# EAGLE design mainBoard (EAGLE 9.4.0)
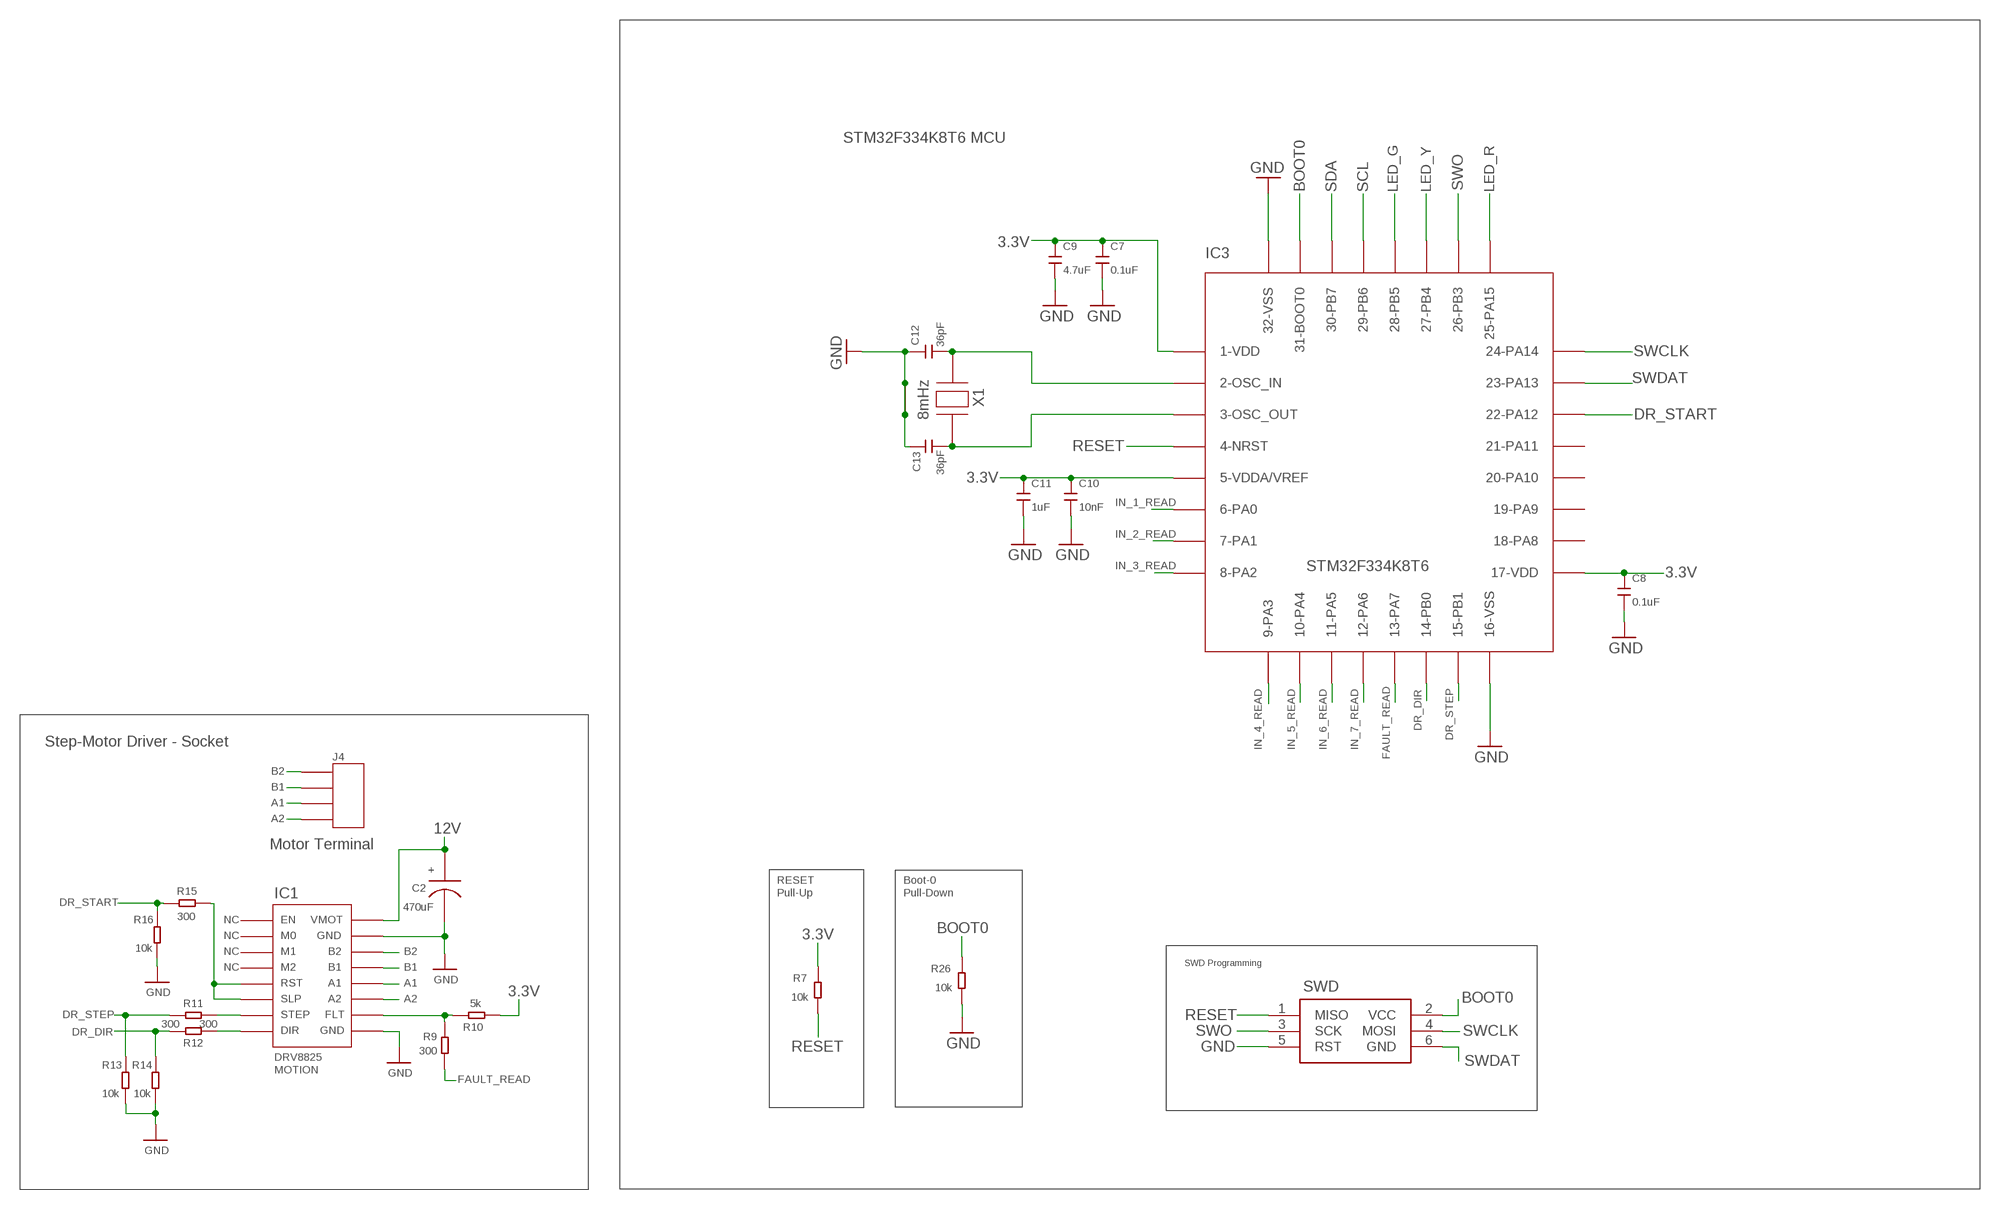
[diagram p0: schematic, sheet 1, part 1 of 2]
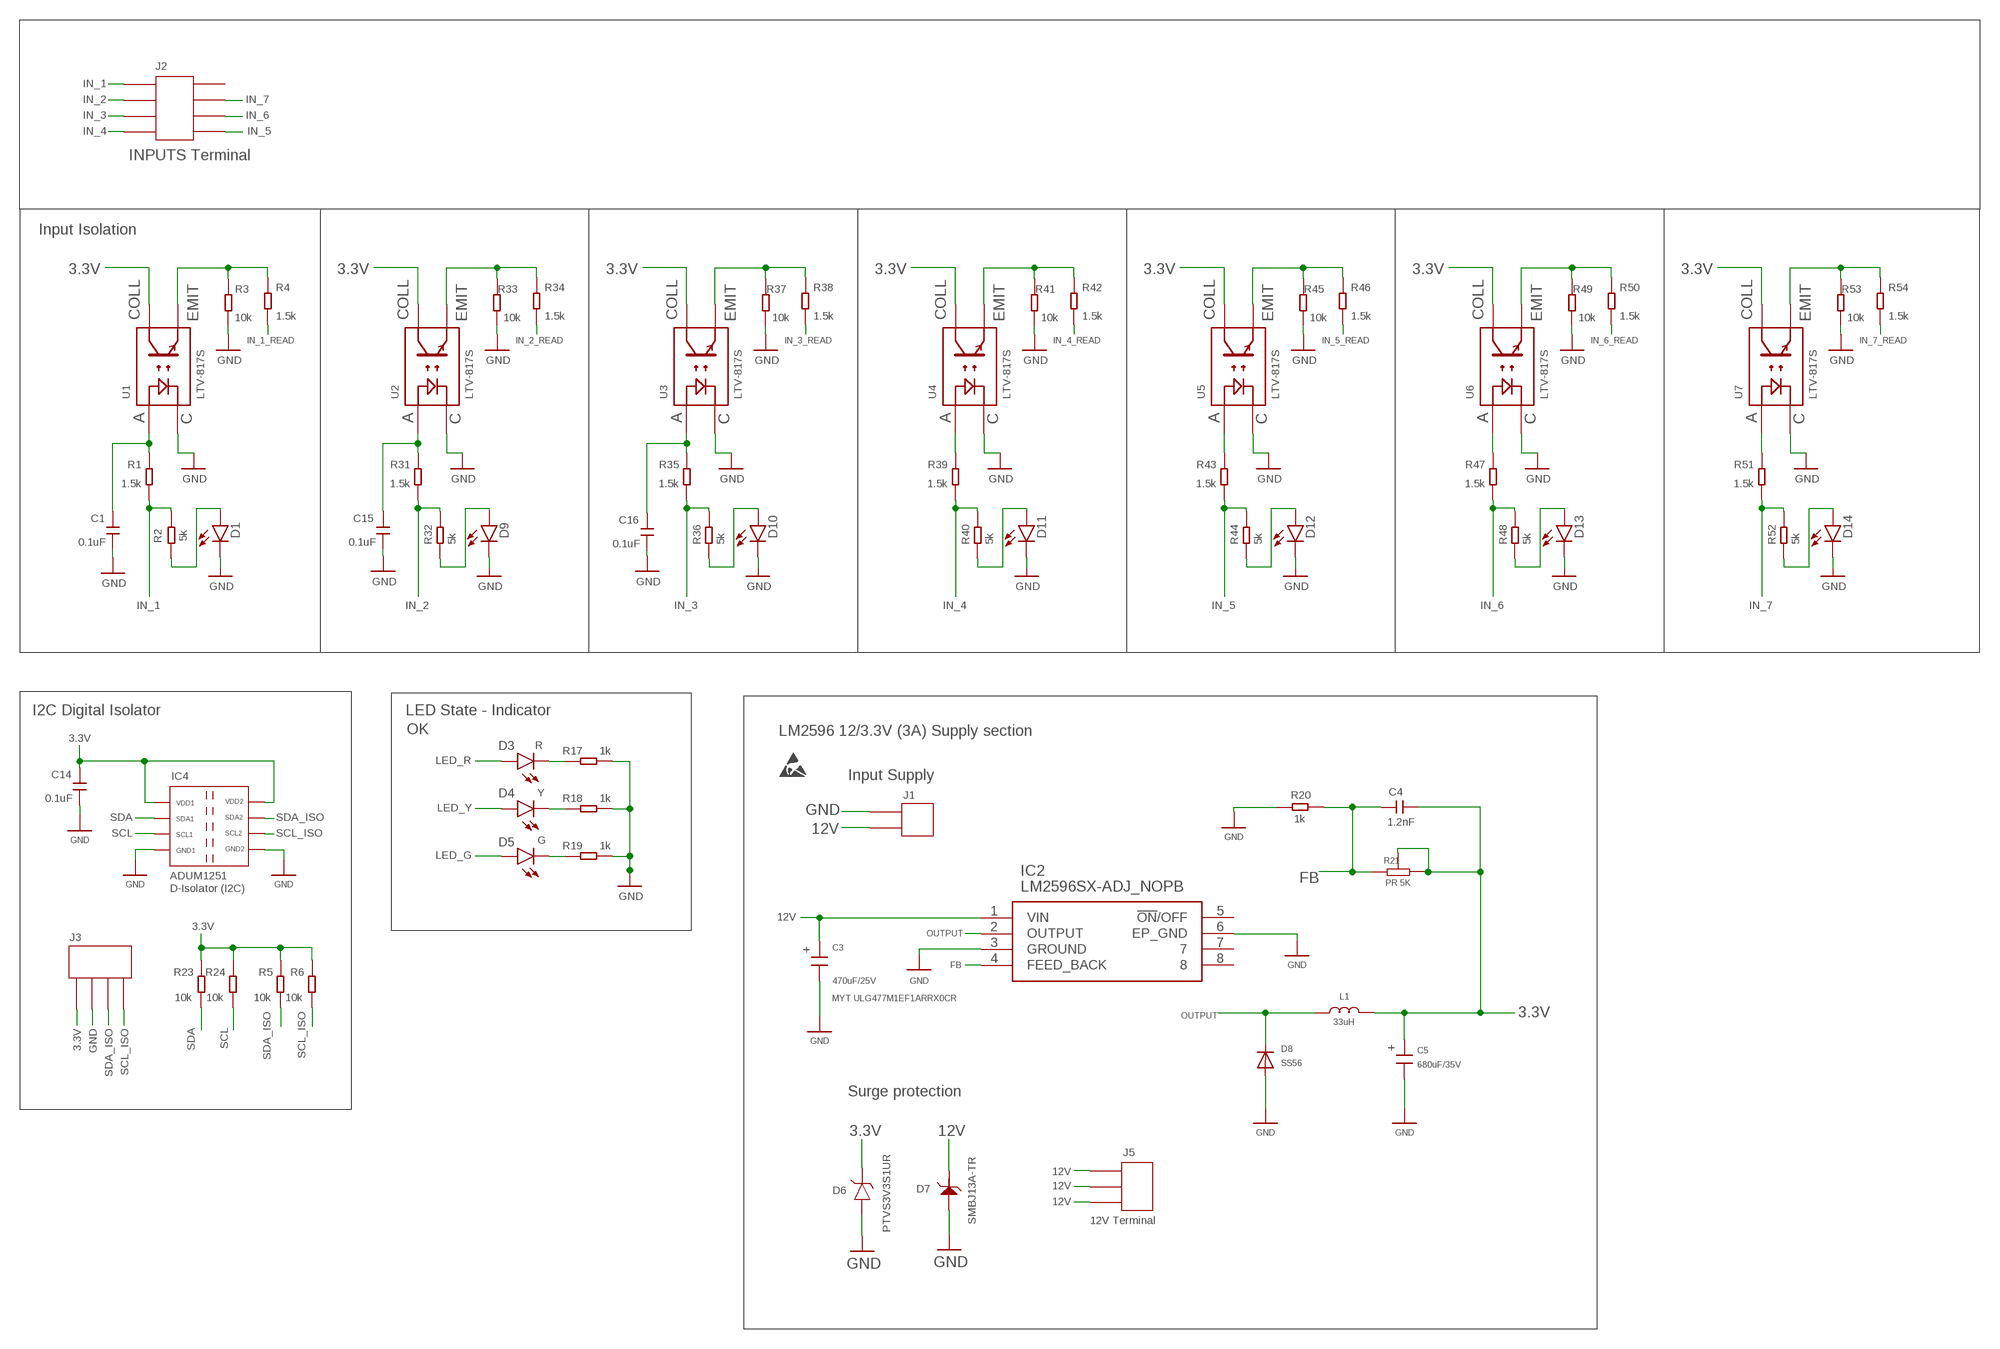
[diagram p1: schematic, sheet 1, part 2 of 2]

## Parts
C1  0.1uF  SMD-CAP-0805  [SMD-CAP-0805]
C2  470uF  EPCOS-CAP-10X16  [EPCOS-CAP-10X16]
C3  MYT-680UF-25V-D8MM-F16  [MYT-680UF-25V-D8MM-F16]
C4  1.2nF  SMD-CAP-0805  [SMD-CAP-0805]
C5  PANASONIC-SMT-CAP-680UF  [PANASONIC-SMT-CAP-680UF]
C7  0.1uF  SMD-CAP-0805  [SMD-CAP-0805]
C8  0.1uF  SMD-CAP-0805  [SMD-CAP-0805]
C9  4.7uF  SMD-CAP-0805  [SMD-CAP-0805]
C10  10nF  SMD-CAP-0805  [SMD-CAP-0805]
C11  1uF  SMD-CAP-0805  [SMD-CAP-0805]
C12  36pF  SMD-CAP-0603  [SMD-CAP-0603]
C13  36pF  SMD-CAP-0603  [SMD-CAP-0603]
C14  0.1uF  SMD-CAP-0805  [SMD-CAP-0805]
C15  0.1uF  SMD-CAP-0805  [SMD-CAP-0805]
C16  0.1uF  SMD-CAP-0805  [SMD-CAP-0805]
D1  LED0603  [LED-0603]
D3  R  LED0603  [LED-0603]
D4  Y  LED0603  [LED-0603]
D5  G  LED0603  [LED-0603]
D6  PTVS3V3S1UR  [PTVS3V3S1UR]
D7  TVS-SMBJ13A-LFUSE  [TVS-SMBJ13A-LFUSE]
D8  S2A  [DO214AA]
D9  LED0603  [LED-0603]
D10  LED0603  [LED-0603]
D11  LED0603  [LED-0603]
D12  LED0603  [LED-0603]
D13  LED0603  [LED-0603]
D14  LED0603  [LED-0603]
IC1  DRV8825-DRIVER  [DRV8825-DRIVER]
IC2  LM2596SX-ADJ_NOPB  [LM2596SXADJNOPB]
IC3  STM32F334K8T6  [QFP80P900X900X160-32N]
IC4  ADUM1251ARZ-RL7  [ADUM1251ARZ-RL7]
J1  DG127-5.0-2P  [DG127-5.0-2P]
J2  5EHDR-08P-5.00  [5EHDR-08P-5.00]
J3  DG127-5.0-4P  [DG127-5.0-4P]
J4  DG127-5.0-4P  [DG127-5.0-4P]
J5  PRESS-TERMINAL-5.0-3P  [PRESS-TERMINAL-5.0-3P]
L1  SUNLTECHTEC-HSLO1365H330MTT  [SUNLTECHTEC-HSLO1365H330MTT]
R1  1.5k  SMD-RES-0805  [R0805]
R2  5k  SMD-RES-0603  [SMD-RES-0603]
R3  10k  SMD-RES-0805  [R0805]
R4  1.5k  SMD-RES-0805  [R0805]
R5  10k  SMD-RES-0805  [R0805]
R6  10k  SMD-RES-0805  [R0805]
R7  10k  SMD-RES-0603  [SMD-RES-0603]
R9  300  SMD-RES-0805  [R0805]
R10  5k  SMD-RES-0805  [R0805]
R11  300  SMD-RES-0805  [R0805]
R12  300  SMD-RES-0805  [R0805]
R13  10k  SMD-RES-0805  [R0805]
R14  10k  SMD-RES-0805  [R0805]
R15  300  SMD-RES-0805  [R0805]
R16  10k  SMD-RES-0805  [R0805]
R17  1k  SMD-RES-0603  [SMD-RES-0603]
R18  1k  SMD-RES-0603  [SMD-RES-0603]
R19  1k  SMD-RES-0603  [SMD-RES-0603]
R20  1k  SMD-RES-0805  [R0805]
R21  BOURNS-3296W-PREC-RESISTOR-5K  [BOURNS-3296W-PREC-RESISTOR-5K]
R23  10k  SMD-RES-0805  [R0805]
R24  10k  SMD-RES-0805  [R0805]
R26  10k  SMD-RES-0603  [SMD-RES-0603]
R31  1.5k  SMD-RES-0805  [R0805]
R32  5k  SMD-RES-0603  [SMD-RES-0603]
R33  10k  SMD-RES-0805  [R0805]
R34  1.5k  SMD-RES-0805  [R0805]
R35  1.5k  SMD-RES-0805  [R0805]
R36  5k  SMD-RES-0603  [SMD-RES-0603]
R37  10k  SMD-RES-0805  [R0805]
R38  1.5k  SMD-RES-0805  [R0805]
R39  1.5k  SMD-RES-0805  [R0805]
R40  5k  SMD-RES-0603  [SMD-RES-0603]
R41  10k  SMD-RES-0805  [R0805]
R42  1.5k  SMD-RES-0805  [R0805]
R43  1.5k  SMD-RES-0805  [R0805]
R44  5k  SMD-RES-0603  [SMD-RES-0603]
R45  10k  SMD-RES-0805  [R0805]
R46  1.5k  SMD-RES-0805  [R0805]
R47  1.5k  SMD-RES-0805  [R0805]
R48  5k  SMD-RES-0603  [SMD-RES-0603]
R49  10k  SMD-RES-0805  [R0805]
R50  1.5k  SMD-RES-0805  [R0805]
R51  1.5k  SMD-RES-0805  [R0805]
R52  5k  SMD-RES-0603  [SMD-RES-0603]
R53  10k  SMD-RES-0805  [R0805]
R54  1.5k  SMD-RES-0805  [R0805]
SWD  AVRISP-6  [AVRISP]
U1  LTV-817S  [LTV-817S]
U2  LTV-817S  [LTV-817S]
U3  LTV-817S  [LTV-817S]
U4  LTV-817S  [LTV-817S]
U5  LTV-817S  [LTV-817S]
U6  LTV-817S  [LTV-817S]
U7  LTV-817S  [LTV-817S]
U$1  ESD-LOGO  [ESD-LOGO]
X1  8mHz  CRYSTALL-YTC-X50328MSB4SI  [CRYSTALL-YTC-X50328MSB4SI]

## Nets
3.3V: C4.2 C5.+ C7.2 C8.2 C9.2 C10.2 C11.2 C14.2 D6.C IC3.1-VDD IC3.5-VDDA/VREF IC3.17-VDD IC4.VDD1 IC4.VDD2 J3.P$1 L1.P$2 R5.2 R6.2 R7.2 R10.2 R21.CW-3 R21.WIPER-2 R23.2 R24.2 U1.COLL(COLLECTOR) U2.COLL(COLLECTOR) U3.COLL(COLLECTOR) U4.COLL(COLLECTOR) U5.COLL(COLLECTOR) U6.COLL(COLLECTOR) U7.COLL(COLLECTOR)
12V: C2.+ C3.+ D7.- IC1.VMOT IC2.1(VIN) J1.P$2 J5.A1 J5.A2 J5.A3 J5.B1 J5.B2 J5.B3
A1: IC1.A1 J4.P$3
A2: IC1.A2 J4.P$4
B1: IC1.B1 J4.P$2
B2: IC1.B2 J4.P$1
BOOT0: IC3.31-BOOT0 R26.2 SWD.2(VCC)
DR_DIR: IC3.14-PB0 R12.1 R14.2
DR_START: IC3.22-PA12 R15.1 R16.2
DR_STEP: IC3.15-PB1 R11.1 R13.2
FAULT_READ: IC3.13-PA7 R9.2
FB: C4.1 IC2.4(FEED_BACK) R20.2 R21.CCW-1
GND: C1.1 C2.- C3.- C5.- C7.1 C8.1 C9.1 C10.1 C11.1 C12.1 C13.1 C14.1 C15.1 C16.1 D1.C D6.A D7.+ D8.A D9.C D10.C D11.C D12.C D13.C D14.C IC1.GND IC1.GND_1 IC2.3(GROUND) IC2.6(EP_GND) IC3.16-VSS IC3.32-VSS IC4.GND1 IC4.GND2 J1.P$1 J3.P$2 R3.2 R13.1 R14.1 R16.1 R17.1 R18.1 R19.1 R20.1 R26.1 R33.2 R37.2 R41.2 R45.2 R49.2 R53.2 SWD.5(RST) U1.C U2.C U3.C U4.C U5.C U6.C U7.C X1.2(G1) X1.4(G2)
IN_1: J2.1 R1.1 R2.2
IN_1_READ: IC3.6-PA0 R4.2
IN_2: J2.2 R31.1 R32.2
IN_2_READ: IC3.7-PA1 R34.2
IN_3: J2.3 R35.1 R36.2
IN_3_READ: IC3.8-PA2 R38.2
IN_4: J2.4 R39.1 R40.2
IN_4_READ: IC3.9-PA3 R42.2
IN_5: J2.5 R43.1 R44.2
IN_5_READ: IC3.10-PA4 R46.2
IN_6: J2.6 R47.1 R48.2
IN_6_READ: IC3.11-PA5 R50.2
IN_7: J2.7 R51.1 R52.2
IN_7_READ: IC3.12-PA6 R54.2
LED_G: D5.A IC3.28-PB5
LED_R: D3.A IC3.25-PA15
LED_Y: D4.A IC3.27-PB4
N$2: D1.A R2.1
N$3: R3.1 R4.1 U1.EMIT(EMITTER)
N$7: IC1.STEP R11.2
N$8: IC1.FAULT R9.1 R10.1
N$9: IC1.DIR R12.2
N$10: D3.C R17.2
N$12: IC1.RST IC1.SLEEP R15.2
N$14: D4.C R18.2
N$17: D5.C R19.2
N$22: C12.2 IC3.2-OSC_IN X1.3
N$23: C13.2 IC3.3-OSC_OUT X1.1
N$24: C15.2 R31.2 U2.A
N$25: D9.A R32.1
N$26: R33.1 R34.1 U2.EMIT(EMITTER)
N$27: C16.2 R35.2 U3.A
N$28: D10.A R36.1
N$29: R37.1 R38.1 U3.EMIT(EMITTER)
N$30: R39.2 U4.A
N$31: D11.A R40.1
N$32: R41.1 R42.1 U4.EMIT(EMITTER)
N$33: R43.2 U5.A
N$34: D12.A R44.1
N$35: R45.1 R46.1 U5.EMIT(EMITTER)
N$36: R47.2 U6.A
N$37: D13.A R48.1
N$38: R49.1 R50.1 U6.EMIT(EMITTER)
N$39: R51.2 U7.A
N$40: D14.A R52.1
N$41: R53.1 R54.1 U7.EMIT(EMITTER)
N$42: C1.2 R1.2 U1.A
OUTPUT: D8.C IC2.2(OUTPUT) L1.P$1
RESET: IC3.4-NRST R7.1 SWD.1(MISO)
SCL: IC3.29-PB6 IC4.SCL1 R24.1
SCL_ISO: IC4.SCL2 J3.P$4 R6.1
SDA: IC3.30-PB7 IC4.SDA1 R23.1
SDA_ISO: IC4.SDA2 J3.P$3 R5.1
SWCLK: IC3.24-PA14 SWD.4(MOSI)
SWDAT: IC3.23-PA13 SWD.6(GND)
SWO: IC3.26-PB3 SWD.3(SCK)
Unconnected: IC1.ENABLE(EN) IC1.M0 IC1.M1 IC1.M2 IC2.5(!ON!/OFF) IC2.7 IC2.8 IC3.18-PA8 IC3.19-PA9 IC3.20-PA10 IC3.21-PA11 J2.8

## Notes on the sheet
- STM32F334K8T6 MCU
- Step-Motor Driver - Socket
- Motor Terminal
- RESET | Boot-0
- Pull-Up | Pull-Down
- NC
- NC
- NC
- SWD Programming
- NC
- INPUTS Terminal
- Input Isolation
- I2C Digital Isolator | LED State - Indicator
- OK | LM2596 12/3.3V (3A) Supply section
- Input Supply
- PR 5K
- 470uF/25V
- MYT ULG477M1EF1ARRX0CR
- 33uH
- SS56 | 680uF/35V
- Surge protection
- SMBJ13A-TR | 12V Terminal

## Library data of the parts
C1 C4 C7-C11 C14-C16 = Network_Board Lib:SMD-CAP-0805
C2 = Elevator:EPCOS-CAP-10X16: EPCOS Capactor 10x16 (Electrilyte)
C3 = Network_Board Lib:MYT-680UF-25V-D8MM-F16: Man Yue Tech ULR687M1EG1BRRX0CR - C1 (Cin) capacitor for LM2596 power board. 680uF, 25V, Low ESR. F16 Size.
C5 = Network_Board Lib:PANASONIC-SMT-CAP-680UF: PANASONIC EEVFK1V681Q - Output Capacitor for LM2596 Power Board. 680uF, 35V, Low impedance, high ESR (This is ok for output capacitor)
C12 C13 = Network_Board Lib:SMD-CAP-0603: CAP 0603 size with Vishay smd design
D1 D3-D5 D9-D14 = SparkFun-LED:LED: LED (Generic) Standard schematic elements and footprints for 5mm, 3mm, 1206, and 0603 sized LEDs. Generic LEDs with no color specified.
D6 = Elevator:PTVS3V3S1UR: PTVS3V3S1UR - Unidirectional TVS diode for 3.3V line surge protection Package: SOD-123W Manufacture: Nexperia
D7 = Network_Board Lib:TVS-SMBJ13A-LFUSE: TVS diode LittleFuse: 1) SMBJ5.0A 2) SMBJ13A 3) All SMB series with package SMB(DO-214AA)
D8 = smb_do14aa:S2*: S2A - S2M General Purpose Rectifiers Source: http://www.fairchildsemi.com/datasheets/S2/S2A.pdf; MF: Fairchild; MPN: S2A; OC_FARNELL: 1467485; OC_NEWARK: 58K2391
IC1 = Elevator:DRV8825-DRIVER: DRV8825 Step Motor Driver Socket (2.54)
IC2 = LM2596SX-ADJ_NOPB:LM2596SX-ADJ_NOPB: SIMPLE SWITCHER® 4.5V to 40V, 3A Low Component Count Step-Down Regulator Source: Datasheet <http://www.ti.com/general/docs/suppproductinfo.tsp?distId=10&gotoUrl=http://www.ti.com/lit/gpn/lm2596>; DESCRIPTION: SIMPLE SWITCHER&#174; 4.5V to 40V, 3A Low Component Count Step-Down Regulator; HEIGHT: 4.65mm; MANUFACTURER_NAME: Texas Instruments; MANUFACTURER_PART_NUMBER: LM2596SX-ADJ/NOPB; MOUSER_PART_NUMBER: 926-LM2596SX-ADJNOPB; MOUSER_PRICE-STOCK: https://www.mouser.com/Search/Refine.aspx?Keyword=926-LM2596SX-ADJNOPB
IC3 = QFP80P900X900X160-32N:STM32F334K8T6
IC4 = Elevator:ADUM1251ARZ-RL7: ADUM1251ARZ-RL7 - Bidirectional Digital Isolator for I2C Bus Manufacture - Analog Devices Package - SOIC-8
J1 = Elevator:DG127-5.0-2P: DG127-5.0-2P - Terminal, x2 pins Step - 5mm
J2 = Elevator:5EHDR-08P-5.00: 5EHDR-08P (Dinkle) - socket Step = 5.00mm X8 pins
J3 J4 = Elevator:DG127-5.0-4P: DG127-5.0-4P - Terminal, x4 pins Step - 5mm
J5 = Elevator:PRESS-TERMINAL-5.0-3P: Press Terminal - x3 pins Step - 5mm
L1 = Network_Board Lib:SUNLTECHTEC-HSLO1365H330MTT: SUNLTECHTEC-HSLO1365H330MTT - Inductor 33uH, 5A, 14.4x12.8x6.5
R1 R3-R6 R9-R16 R20 R23 R24 R31 R33-R35 R37-R39 R41-R43 R45-R47 R49-R51 R53 R54 = Network_Board Lib:SMD-RES-0805: Vishay SMD resistor (Density level A-B). Recommended for use.; MPN: RL0805JR-070R1L; VALUE: 0.1R
R2 R7 R17-R19 R26 R32 R36 R40 R44 R48 R52 = Network_Board Lib:SMD-RES-0603: SMD Resistor 0603 Size Reccomended for use. Vishay design source
R21 = Network_Board Lib:BOURNS-3296W-PREC-RESISTOR-5K: BOURNS 3296W-1-502LF - Precision Potenciometr for LM2596 Power Board. 5kOhms
SWD = adafruit:AVRISP: AVR ISP HEADER Standard 6 pin header for AVR programming
U1-U7 = Elevator:LTV-817S: LTV-817S - SMD optocoupler (PC817 analog)
U$1 = Network_Board Lib:ESD-LOGO
X1 = Network_Board Lib:CRYSTALL-YTC-X50328MSB4SI: SMD Crystall Yangxing Tech X50328MSB4SI 8mHz, 30ppm, SMD5032_4P

## Net classes
1 +12V: width 0.61 mm, drill 0.584 mm

## Board
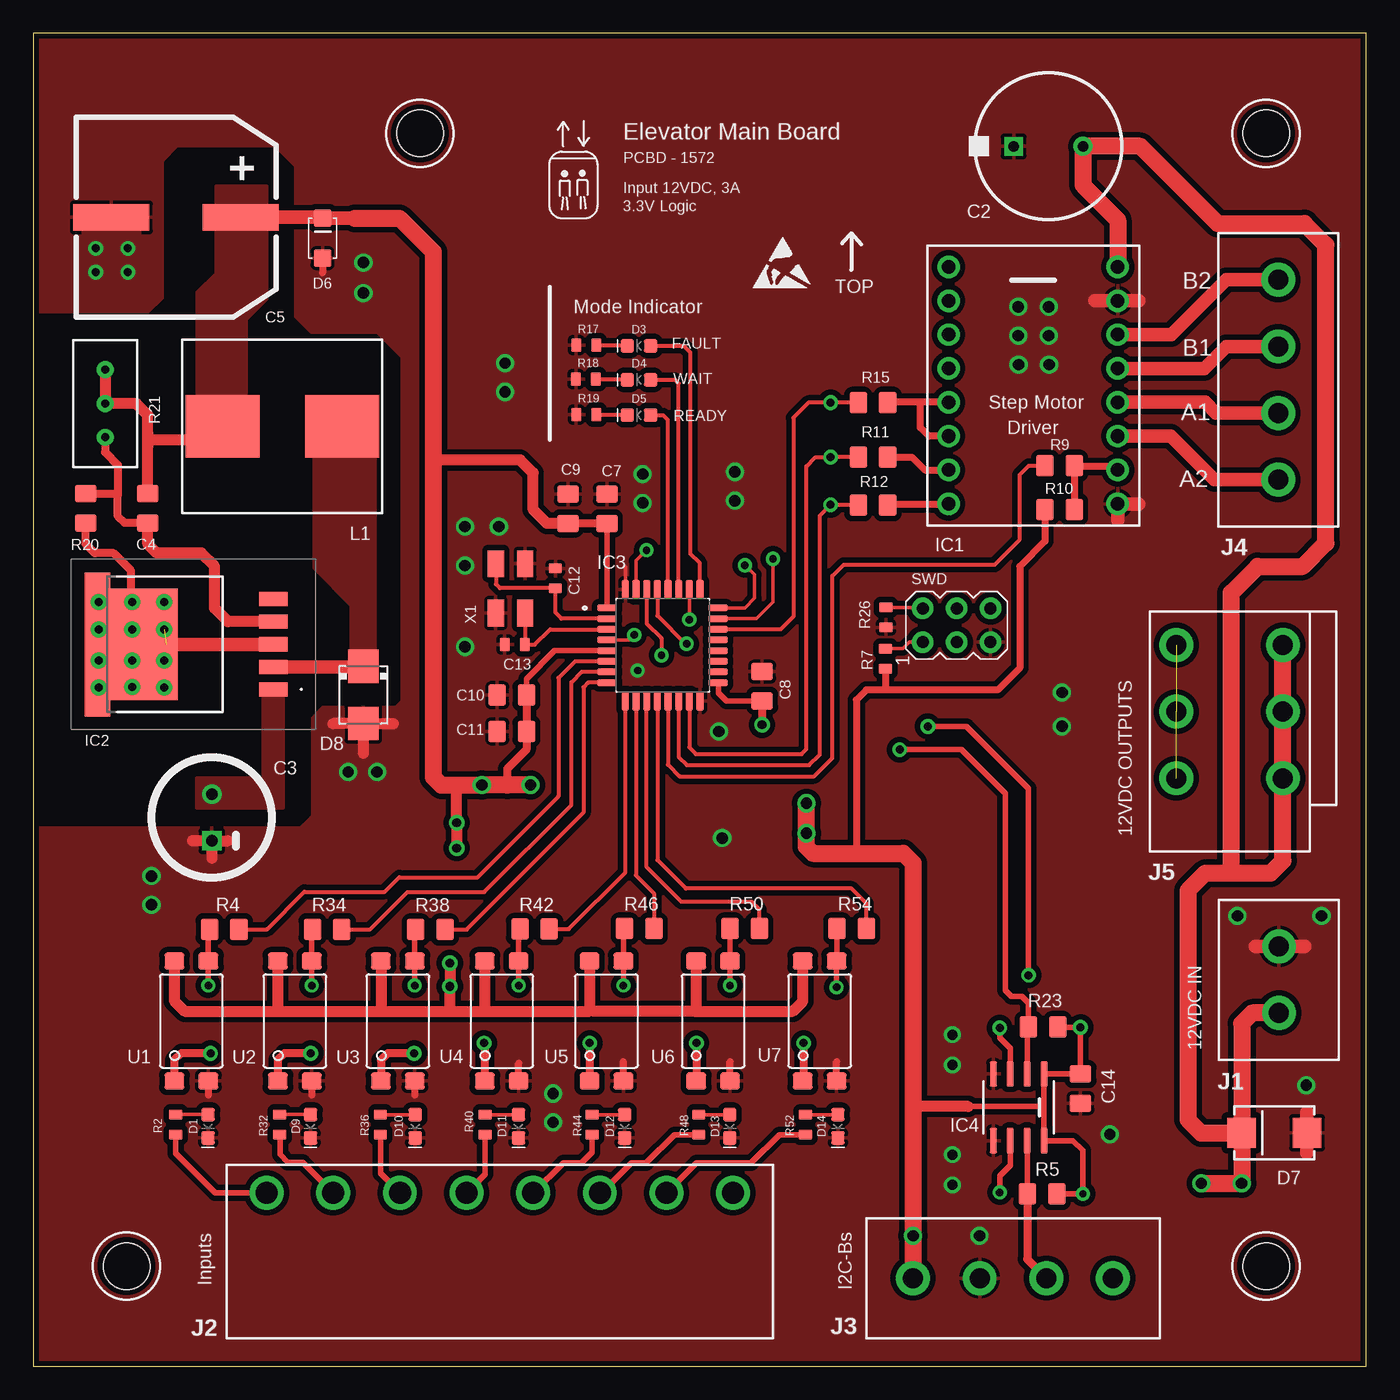
[diagram p2: board, top side]
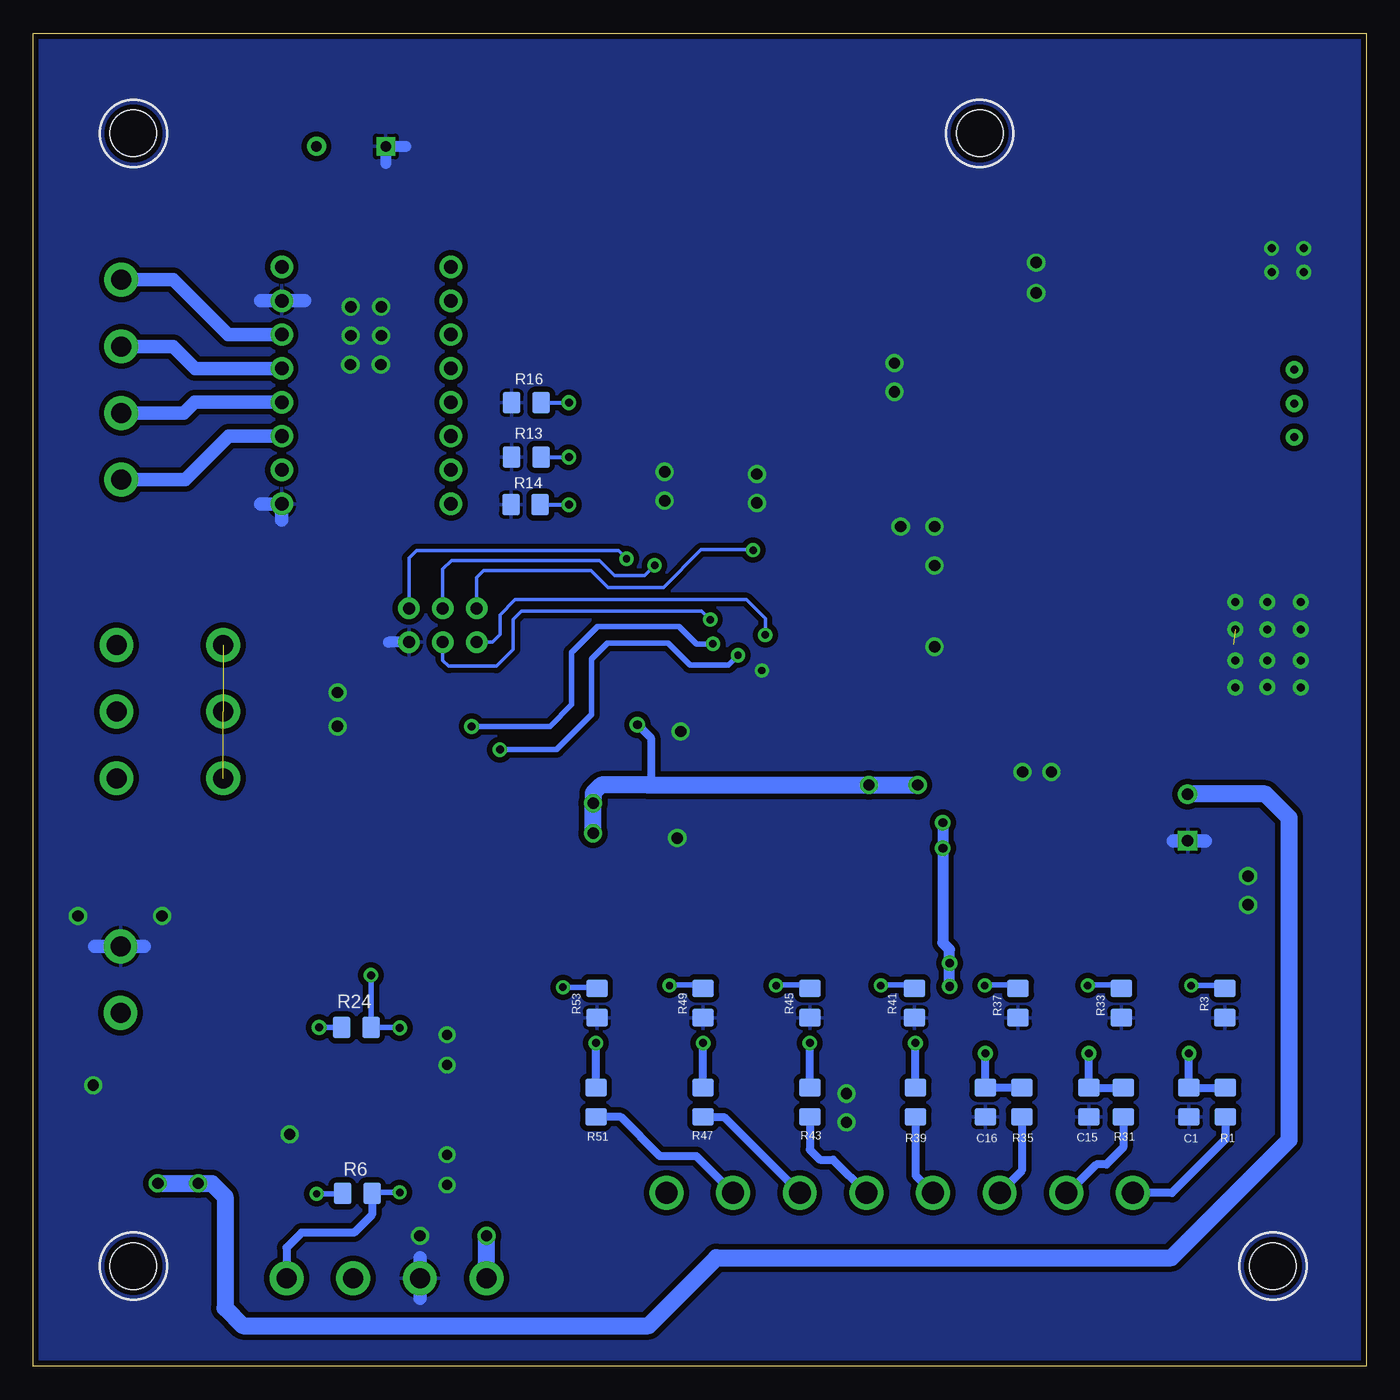
[diagram p3: board, bottom side, seen from below]

Size 100 x 100 mm. Coordinates in mm from the lower left corner, seen from the top.
Outline: 0,0 100,0 100,100 0,100 0,0
Copper layers (1*16): Top 0.035mm / dielectric 1.5mm / Bottom 0.035mm
Design rules "SparkFun PCB Checker": minimum track width 8mil, minimum drill 20mil, track to track 8mil, track to pad 8mil, pad to pad 8mil, via to via 8mil, smd to smd 8mil, copper to edge 8mil, drill to drill 8mil, minimum pad ring 12mil, minimum via ring 10mil, stop-mask expansion 4mil, vias tented up to drill 20mil, thermal gap 10mil
Holes 3.5 mm at 92.5,7.5 7,7.5 29,92.5 92.5,92.5

### Footprints (pad centres in the part's own frame; a part is rotated, then mirrored left to right if it is on the bottom)
SMD-CAP-0805 = smd 1.6 x 1.3: 1 0,1.1; 2 0,-1.1
EPCOS-CAP-10X16 = drill 0.8 pad 1.422: + -2.6,0 | drill 0.8 square: - 2.6,0
MYT-680UF-25V-D8MM-F16 = drill 0.85 pad 1.422: + -1.75,0 | drill 0.85 pad 1.422 square: - 1.75,0
PANASONIC-SMT-CAP-680UF = smd 5.7 x 2: + 4.85,0; - -4.85,0
SMD-CAP-0603 = smd 0.75 x 1: 1 -0.75,0; 2 0.75,0
LED-0603 = smd 1 x 1: A -0.877,0; C 0.877,0
PTVS3V3S1UR = smd 1.3 x 1.3: A -1.5,0; C 1.5,0
TVS-SMBJ13A-LFUSE = smd 2.16 x 2.26: + 2.45,0; - -2.45,0
DO214AA = smd 2.5 x 2.3: A 2.15,0; C -2.15,0
DRV8825-DRIVER = drill 1.02 pad 1.676: A1 12.7,-10.16; A2 12.7,-12.7; B1 12.7,-7.62; B2 12.7,-5.08; DIR 0,-17.78; ENABLE 0,0; FAULT 12.7,-15.24; GND 12.7,-2.54; GND_1 12.7,-17.78; M0 0,-2.54; M1 0,-5.08; M2 0,-7.62; RST 0,-10.16; SLEEP 0,-12.7; STEP 0,-15.24; VMOT 12.7,0
LM2596SXADJNOPB = smd 2.16 x 1.07: 1 5.531,-3.4; 2 5.531,-1.7; 3 5.531,0; 4 5.531,1.7; 5 5.531,3.4 | smd 6.99 x 8.33: 6 -5.144,0 | smd 1.91 x 1.235: 7 -7.684,4.782; 8 -7.684,-4.782
QFP80P900X900X160-32N = smd 1.47 x 0.54: 1-VDD -4.17,2.8; 2-OSC_IN -4.17,2; 3-OSC_OUT -4.17,1.2; 4-NRST -4.17,0.4; 5-VDDA/VREF -4.17,-0.4; 6-PA0 -4.17,-1.2; 7-PA1 -4.17,-2; 8-PA2 -4.17,-2.8; 17-VDD 4.17,-2.8; 18-PA8 4.17,-2; 19-PA9 4.17,-1.2; 20-PA10 4.17,-0.4; 21-PA11 4.17,0.4; 22-PA12 4.17,1.2; 23-PA13 4.17,2; 24-PA14 4.17,2.8 | smd 0.54 x 1.47: 9-PA3 -2.8,-4.17; 10-PA4 -2,-4.17; 11-PA5 -1.2,-4.17; 12-PA6 -0.4,-4.17; 13-PA7 0.4,-4.17; 14-PB0 1.2,-4.17; 15-PB1 2,-4.17; 16-VSS 2.8,-4.17; 25-PA15 2.8,4.17; 26-PB3 2,4.17; 27-PB4 1.2,4.17; 28-PB5 0.4,4.17; 29-PB6 -0.4,4.17; 30-PB7 -1.2,4.17; 31-BOOT0 -2,4.17; 32-VSS -2.8,4.17
ADUM1251ARZ-RL7 = smd 1.9 x 0.56: GND1 -2.5,-3.81; GND2 2.5,-3.81; SCL1 -2.5,-2.54; SCL2 2.5,-2.54; SDA1 -2.5,-1.27; SDA2 2.5,-1.27; VDD1 -2.5,0; VDD2 2.5,0
DG127-5.0-2P = drill 1.5 pad 2.54: P$1 0,0; P$2 5,0
5EHDR-08P-5.00 = drill 1.65 pad 2.54: 1 -17.5,0; 2 -12.5,0; 3 -7.5,0; 4 -2.5,0; 5 2.5,0; 6 7.5,0; 7 12.5,0; 8 17.5,0
DG127-5.0-4P = drill 1.5 pad 2.54: P$1 0,0; P$2 5,0; P$3 10,0; P$4 15,0
PRESS-TERMINAL-5.0-3P = drill 1.5 pad 2.54: A1 0,0; A2 -5,0; A3 -10,0; B1 0,8; B2 -5,8; B3 -10,8
SUNLTECHTEC-HSLO1365H330MTT = smd 5.55 x 4.7: P$1 -4.475,0; P$2 4.475,0
R0805 = smd 1.6 x 1.3: 1 0,1.1; 2 0,-1.1
SMD-RES-0603 = smd 0.75 x 1: 1 -0.76,0.04; 2 0.74,0.04
BOURNS-3296W-PREC-RESISTOR-5K = drill 0.6 pad 1.27: CCW-1 -2.54,0; CW-3 2.54,0; WIPER-2 0,0
AVRISP = drill 0.9 pad 1.626: 1 -1.27,2.54; 2 1.27,2.54; 3 -1.27,0; 4 1.27,0; 5 -1.27,-2.54; 6 1.27,-2.54
LTV-817S = smd 1.5 x 1.3: A -1.27,-9; C 1.27,-9; COLL -1.27,0; EMIT 1.27,0
CRYSTALL-YTC-X50328MSB4SI = smd 2 x 1.2: 1 -1.85,-1.1; 2 1.85,-1.1; 3 1.85,1.1; 4 -1.85,1.1

### Placement (x,y rotation side)
C1  13.29,19.8 180 bottom
C2  76.16,91.52 180 top
C3  13.39,41.17 270 top
C4  8.59,64.36 180 top
C5  10.71,86.19 0 top
C7  43.04,64.33 0 top
C8  54.67,51.01 0 top
C9  40.1,64.33 0 top
C10  35.9,50.34 90 top
C11  35.9,47.63 90 top
C12  39.16,59.11 270 top
C13  36.12,54.13 0 top
C14  78.56,20.83 180 top
C15  20.81,19.8 180 bottom
C16  28.58,19.8 180 bottom
D1  13.11,18 270 top
D3  45.44,76.55 180 top
D4  45.44,74 180 top
D5  45.44,71.35 180 top
D6  21.7,84.63 90 top
D7  93.11,17.5 0 top
D8  24.75,50.37 270 top
D9  20.8,18 270 top
D10  28.65,18 270 top
D11  36.4,18 270 top
D12  44.37,18 270 top
D13  52.25,18 270 top
D14  60.37,18 270 top
IC1  68.66,82.48 0 top
IC2  12.48,54.16 0 top
IC3  47.22,54.09 0 top
IC4  75.83,19.42 270 top
J1  93.46,31.5 270 top
J2  35,13 0 top
J3  66,6.6 0 top
J4  93.4,81.51 270 top
J5  93.76,54.11 90 top
L1  18.68,70.52 180 top
R1  10.56,19.8 180 bottom
R2  10.65,18.1 270 top
R3  10.6,27.25 0 bottom
R4  14.32,32.79 90 top
R5  75.68,12.93 90 top
R6  75.7,12.96 270 bottom
R7  63.9,53.07 270 top
R9  77,67.56 270 top
R10  77,64.28 270 top
R11  63,68.2 90 top
R12  63,64.6 90 top
R13  63.02,68.22 90 bottom
R14  63.07,64.63 90 bottom
R15  63,72.29 90 top
R16  63.01,72.29 90 bottom
R17  41.48,76.55 0 top
R18  41.46,74 0 top
R19  41.49,71.35 0 top
R20  3.92,64.36 180 top
R21  5.39,72.23 90 top
R23  75.76,25.45 90 top
R24  75.76,25.41 270 bottom
R26  64,56.19 90 top
R31  18.23,19.8 180 bottom
R32  18.45,18.1 270 top
R33  18.38,27.25 0 bottom
R34  22.04,32.78 90 top
R35  25.83,19.8 180 bottom
R36  26,18.1 270 top
R37  26.13,27.25 0 bottom
R38  29.79,32.76 90 top
R39  33.82,19.8 180 bottom
R40  33.86,18.1 270 top
R41  33.89,27.25 0 bottom
R42  37.6,32.79 90 top
R43  41.75,19.8 180 bottom
R44  41.87,18.1 270 top
R45  41.75,27.25 0 bottom
R46  45.46,32.84 90 top
R47  49.75,19.8 180 bottom
R48  49.89,18.1 270 top
R49  49.75,27.25 0 bottom
R50  53.37,32.84 90 top
R51  57.79,19.8 180 bottom
R52  57.89,18.1 270 top
R53  57.71,27.25 0 bottom
R54  61.41,32.84 90 top
SWD  69.28,55.59 90 top
U1  11.86,30.4 0 top
U2  19.62,30.4 0 top
U3  27.35,30.4 0 top
U4  35.14,30.4 0 top
U5  43,30.4 0 top
U6  51,30.4 0 top
U7  59,30.4 0 top
U$1  53.82,80.58 0 top
X1  35.8,58.36 90 top

### Tracks (layer width: path | path; a pad name or v marks a point on that pad's centre or on a via)
3.3V  (via drill 0.55, 0.6, 0.65, 0.85)
  Top 0.406: 75.83,19.49 IC4.VDD2 78,16.92 78.75,16.18 v78.75,12.93 R5.2 | 75.83,19.49 IC4.VDD1 C14.2 v78.56,25.41 76.89,25.41 R23.2 | IC3.1-VDD C7.2 | IC3.17-VDD 51.4,51.27 51.4,50.52 52.01,49.91 C8.2 | 37,50 37,51.57 39.12,53.69 IC3.5-VDDA/VREF | 75.83,19.49 70.14,19.49 | 8.59,69 8.59,70 | 41.45,26.64 41.73,26.64 42,26.64
  Top 0.508: 63.88,50.75 72.36,50.75 74,52.38 74,60 75.9,61.9 R10.2 | 63.88,50.75 62.49,50.75 61.75,50 61.75,38.48 | R7.2 63.94,50.8 63.88,50.75
  Top 0.61: C7.2 C9.2 | C10.2 37,50 C11.2 37,46.25 35.56,44.81 35.56,43.6 | C8.2 v54.67,48.13
  Top 0.813: 18.35,26.64 11.37,26.64 10.59,27.41 U1.COLL | U2.COLL 18.35,26.64 | 18.35,26.64 26,26.64 | 26,26.64 31.25,26.64 | 31.25,26.64 33.87,26.64 | 33.87,26.64 41.73,26.64 U5.COLL | 49.58,26.64 42,26.64 | U3.COLL 26.08,26.71 26,26.64 | U4.COLL 33.87,26.64 | U6.COLL 49.73,26.79 49.58,26.64 | R21.CW-3 R21.WIPER-2 7.73,72.23 8.59,71.36 8.59,70 8.59,69.09 | C4.2 8.59,69 8.59,69.48 13.15,69.48 L1.P$2 | C9.2 38.53,63.23 37.51,64.25 37.51,67.02 36.52,68 30,68 | 31.25,26.64 v31.25,28.49 v31.25,30.24 | v31.76,38.87 v31.76,40.77 31.76,43.37 32,43.6 | 49.58,26.64 56.99,26.64 57.73,27.38 U7.COLL | 70.14,19.49 66,19.49
  Top 1.016: C5.+ 21.64,86.19 D6.C 24.11,86.13
  Top 1.27: 24.11,86.13 27.47,86.13 30,83.6 30,68 30,44.21 30.6,43.6 32,43.6 v33.65,43.6 35.56,43.6 v37.31,43.6 | J3.P$1 v66,9.78 66,19.49 66,37.75 65.28,38.48 61.75,38.48 58.49,38.48 58,38.97 v58,39.98 v58,42.24
  Bottom 0.406: R24.2 v78.56,25.41 | v78.75,12.93 76.83,12.93 R6.2
  Bottom 0.61: v54.67,48.13 53.67,47.13 53.67,43.79 53.86,43.6
  Bottom 0.813: v31.25,28.49 v31.25,30.24 31.25,31.25 31.76,31.76 v31.76,38.87 v31.76,40.77
  Bottom 1.27: v33.65,43.6 v37.31,43.6 53.86,43.6 57.4,43.6 58,43 v58,42.24 v58,39.98 | J3.P$1 v66,9.78
  pour Top (no thermals): 12.3,72.31 12.3,80.57 13.7,81.96 13.7,88.53 17.51,88.53 17.51,80.06 15.99,78.53 15.99,72.31
12V  (via drill 0.85)  (2 unrouted)
  Top 1.27: J5.A1 J5.A2 J5.A3 93.76,37.92 92.84,37 89.87,37 | J1.P$2 91.44,26.5 90.66,25.71 D7.- | 89.87,37 87.93,37 86.62,35.69 86.62,18.49 87.61,17.5 D7.- | 89.87,37 89.87,58.02 91.86,60 95.24,60 96.98,61.75 96.98,84.11 95.36,85.73 88.86,85.73 83.07,91.52 C2.+ 78.76,88.61 81.36,86 IC1.VMOT | D7.- v90.66,13.72 v87.63,13.72
  Bottom 1.27: C3.+ 7.55,42.92 5.78,41.14 5.78,16.97 14.6,8.14 48.75,8.14 53.84,3.05 84.29,3.05 85.62,4.38 85.62,12.72 86.61,13.72 v87.63,13.72 v90.66,13.72
  pour Top (no thermals): 12.25,44.13 12.25,41.89 18.73,41.89 18.73,51.02 17.25,51.02 17.25,44.13
A1
  Top 1.016: IC1.A1 87.92,72.32 88.73,71.51 J4.P$3
  Bottom 1.016: J4.P$3 88.71,71.51 87.9,72.32 IC1.A1
A2
  Top 1.016: J4.P$4 88.6,66.51 85.33,69.78 IC1.A2
  Bottom 1.016: J4.P$4 88.6,66.51 85.33,69.78 IC1.A2
B1
  Top 1.016: J4.P$2 89.49,76.51 87.84,74.86 IC1.B1
  Bottom 1.016: J4.P$2 89.51,76.51 87.86,74.86 IC1.B1
B2
  Top 1.016: IC1.B2 85.38,77.4 89.49,81.51 J4.P$1
  Bottom 1.016: IC1.B2 85.4,77.4 89.51,81.51 J4.P$1
BOOT0  (via drill 0.55)
  Top 0.254: v46,61.22 45.22,60.44 IC3.31-BOOT0 | R26.2 66.67,56.93 SWD.2
  Bottom 0.254: 66.73,57.27 SWD.2 66.73,59.18 66.23,59.69 58.17,59.69 56.9,58.42 52.72,58.42 49.89,61.25 46.03,61.25 v46,61.22
DR_DIR  (via drill 0.6)
  Top 0.305: IC3.14-PB0 48.42,45.71 49.03,45.09 58.2,45.09 59,45.89 59,63.81 v59.82,64.63 59.84,64.6 R12.1
  Bottom 0.305: R14.2 v59.82,64.63
DR_START  (via drill 0.6)
  Top 0.305: IC3.22-PA12 56.06,55.29 57.02,56.24 57.02,71.17 58.14,72.29 v59.82,72.29 R15.1
  Bottom 0.305: R16.2 v59.82,72.29
DR_STEP  (via drill 0.6)
  Top 0.305: IC3.15-PB1 49.22,46.42 49.7,45.93 57.63,45.93 58,46.3 58,67.51 58.69,68.2 v59.82,68.2 R11.1
  Bottom 0.305: R13.2 R11.1 v59.82,68.2
FAULT_READ
  Top 0.305: IC3.13-PA7 47.62,45.13 48.49,44.25 58.59,44.25 59.95,45.62 59.95,59.29 60.81,60.14 72.13,60.14 74.02,62.03 74.02,66.89 74.69,67.56 R9.2
FB
  Top 0.61: C4.1 6.84,63.27 6.35,63.76 6.35,65.36 | 6.35,65.36 6.35,67.61 5.39,68.57 R21.CCW-1 | R20.2 6.25,65.47 6.35,65.36
  Top 0.813: C4.1 8.59,61.66 9.24,61.02 12.6,61.02 13.6,60.02 13.6,56.87 14.61,55.86 IC2.4
GND  (via drill 0.55, 0.6, 0.6 pad 1.2, 0.75, 0.85)  (1 unrouted)
  Top 0.254: IC3.32-VSS 44.42,60
  Top 0.508: U4.C 36.41,22.73 | U5.C 44.27,22.86 | U6.C 52.27,22.86 | U7.C 60.27,22.86 | U2.C 20.89,20.32 | U3.C 28.62,20.32 | U1.C 13.13,20.32 | D6.A 21.7,82.04
  Top 0.61: IC2.6 7.33,59.69 6.03,61 4.62,61 3.92,61.7 R20.1
  Top 0.813: D8.A 24.75,46 | D8.A 27,48.22 | D8.A 22.48,48.22 | C3.- 13.39,38.1 | C3.- 11.94,39.42 | C3.- 14.61,39.42 | IC2.6 7.41,54.08 v7.41,52.96
  Top 1.016: IC2.3 9.98,54.16 | 95.38,31.5 J1.P$1 91.69,31.5 | 95.56,19.05 D7.+ 95.56,16 | 79.63,79.94 IC1.GND 82.93,79.94 | 82.93,64.7 IC1.GND_1 81.36,63.5
  Bottom 0.813: SWD.5 73.35,54.32 | 72.05,91.52 C2.- 73.56,90.25
  Bottom 1.016: 12.06,39.42 C3.- 14.48,39.42 | 91.69,31.5 J1.P$1 95.38,31.5 | 71,8.13 J3.P$2 71,5.08 | 79.63,79.94 IC1.GND 82.93,79.94 | 82.93,64.7 IC1.GND_1 81.36,63.5
  other vias: 4.91,57.34 7.41,57.34 9.81,57.34 4.91,55.29 7.41,55.29 9.81,55.29 4.91,52.96 9.81,52.96 4.91,50.91 9.81,50.91 7.41,50.96 4.68,83.87 4.68,82.09 7.1,83.87 7.1,82.09 34.92,62.99 32.38,62.99 32.38,60.07 32.38,53.98 45.72,66.93 45.72,64.77 68.96,15.88 68.96,13.59 68.96,24.88 68.96,22.59 25.78,44.58 23.62,44.58 24.77,82.8 24.77,80.52 8.86,36.77 8.86,34.61 38.99,20.45 38.99,18.29 70.99,9.78 80.77,17.4 95.5,21.08 96.65,33.78 90.34,33.79 73.9,79.48 73.9,77.32 76.19,79.48 76.19,77.32 73.92,75.14 76.21,75.14 51.44,47.62 45.34,52.2 52.63,67.1 52.63,64.94 51.69,39.62 35.39,75.26 35.39,73.1 77.18,50.55 77.18,48.01
  pour Top (no thermals): 3.75,86.36 3.75,80.98 7.98,80.98 7.98,86.36
  pour Bottom (isolate 0.406, rank 2): 0,100 100,100 100,0 0,0
  pour Top (isolate 0.406, rank 2): 2.67,100 100,100 100,0 0,0 0,40.39 20.07,40.39 20.95,41.27 20.95,48.64 21.72,49.4 27.18,49.4 27.69,49.91 27.69,75.69 25.78,77.6 20.83,77.6 19.68,78.74 19.68,90.04 18.16,91.57 10.79,91.57 9.65,90.42 9.65,80.14 8.64,79.12 0,79.12 0,99.95
IN_1
  Top 0.406: J2.1 13.65,13 10.69,15.96 R2.2
  Bottom 0.61: R1.1 10.56,17 14.57,13 J2.1
IN_1_READ
  Top 0.305: R4.2 17.53,32.79 20.33,35.59 26.36,35.59 27.46,36.68 33.33,36.68 39.4,42.75 39.4,51.63 40.65,52.89 IC3.6-PA0
IN_2
  Top 0.406: R32.2 18.5,17.34 18.5,15.88 19.09,15.29 20.21,15.29 J2.2
  Bottom 0.61: J2.2 22.37,13 20.23,15.14 19.49,15.14 18.23,16.41 R31.1
IN_2_READ
  Top 0.305: R34.2 25.27,32.78 28.06,35.57 33.83,35.57 40.37,42.11 40.37,51.31 41.14,52.09 IC3.7-PA1
IN_3
  Top 0.406: J2.3 26.04,14.46 R36.2
  Bottom 0.61: J2.3 25.83,14.67 R35.1
IN_3_READ
  Top 0.305: R38.2 32.51,32.76 41.27,41.53 41.27,50.93 41.63,51.29 IC3.8-PA2
IN_4
  Top 0.406: J2.4 33.9,14.4 R40.2
  Bottom 0.61: J2.4 33.82,14.32 R39.1
IN_4_READ
  Top 0.305: IC3.9-PA3 44.42,37.05 40.16,32.79 R42.2
IN_5
  Top 0.406: J2.5 39.77,15.27 41.14,15.27 41.91,16.04 R44.2
  Bottom 0.61: R43.1 41.75,16.24 41,15.49 39.99,15.49 J2.5
IN_5_READ
  Top 0.305: IC3.10-PA4 45.22,36.82 46.56,35.48 R46.2
IN_6
  Top 0.406: J2.6 42.63,13 44.88,15.25 45.98,15.25 48.09,17.36 R48.2
  Bottom 0.61: J2.6 48.2,18.7 R47.1
IN_6_READ
  Top 0.305: R50.2 54.47,34.26 53.89,34.84 48.62,34.84 46.02,37.44 IC3.11-PA5
IN_7
  Top 0.406: J2.7 49.75,15.25 53.86,15.25 55.96,17.36 R52.2
  Bottom 0.61: J2.7 50.26,15.76 52.98,15.76 55.92,18.7 R51.1
IN_7_READ
  Top 0.305: R54.2 62.51,34.73 61.4,35.84 48.95,35.84 46.82,37.98 IC3.12-PA6
LED_G
  Top 0.305: D5.A 47.24,71.35 47.62,70.98 IC3.28-PB5
LED_R
  Top 0.305: D3.A 48.8,76.55 49.28,76.07 49.28,60.98 50.02,60.24 IC3.25-PA15
LED_Y
  Top 0.305: D4.A 48.13,74 48.42,73.72 IC3.27-PB4
N$2
  Top 0.254: R2.1 10.71,18.88 D1.A
N$3  (via drill 0.55)
  Top 0.406: v13.13,28.56 U1.EMIT 13.13,32.69 R4.1
  Bottom 0.406: v13.13,28.56 10.59,28.56 10.51,28.48 10.51,28.45 R3.1
N$7
  Top 0.508: IC1.STEP 66.89,67.24 65.92,68.2 R11.2
N$8
  Top 0.508: IC1.FAULT 81.11,67.49 78.17,67.49 R9.1 R10.1
N$9
  Top 0.508: R12.2 64.2,64.7 IC1.DIR
N$10
  Top 0.305: D3.C 42.26,76.55 R17.2
N$12
  Top 0.508: IC1.RST 66.55,72.32 | IC1.SLEEP 67.18,69.78 66.55,70.41 66.55,72.32 | 66.55,72.32 64.12,72.32
  Top 0.61: 64.12,72.32 R15.2
N$14
  Top 0.305: D4.C 42.24,74 R18.2
N$17
  Top 0.305: D5.C 42.27,71.35 R19.2
N$22
  Top 0.305: X1.3 34.7,58.68 35,58.38 39.14,58.38 C12.2 39.16,56.55 39.62,56.09 IC3.2-OSC_IN
N$23
  Top 0.305: X1.1 36.9,54.16 C13.2 37.62,54.13 38.78,55.29 IC3.3-OSC_OUT
N$24  (via drill 0.6)
  Top 0.61: v20.81,23.48 18.84,23.48 18.35,22.98 U2.A
  Bottom 0.508: C15.2
  Bottom 0.61: C15.2 R31.2 | C15.2 v20.81,23.48
N$25
  Top 0.254: R32.1 18.54,18.91 18.57,18.88 D9.A
N$26  (via drill 0.55)
  Top 0.406: v20.89,28.56 U2.EMIT 20.89,32.73 R34.1
  Bottom 0.406: v20.89,28.56 20.84,28.6 18.64,28.6 R33.1
N$27  (via drill 0.6)
  Top 0.61: v28.58,23.48 26.59,23.48 26.08,22.97 U3.A
  Bottom 0.61: R35.2 C16.2 v28.58,23.48
N$28
  Top 0.254: D10.A 28.63,18.86 R36.1
N$29  (via drill 0.55)
  Top 0.406: v28.62,28.56 U3.EMIT 28.62,32.7 R38.1
  Bottom 0.406: v28.62,28.56 28.57,28.6 26.38,28.6 R37.1
N$30  (via drill 0.6)
  Top 0.508: v33.82,24.24 33.87,24.18
  Top 0.61: 33.87,24.18 U4.A
  Bottom 0.61: R39.2 v33.82,24.24
N$31
  Top 0.254: D11.A 36.38,18.86 R40.1
N$32  (via drill 0.55)
  Top 0.406: v36.41,28.56 U4.EMIT 36.41,32.7 R42.1
  Bottom 0.406: R41.1 34.14,28.6 36.37,28.6 v36.41,28.56
N$33  (via drill 0.6)
  Top 0.508: 41.75,21.42 U5.A
  Top 0.61: v41.75,24.24 41.75,21.42
  Bottom 0.61: R43.2 v41.75,24.24
N$34
  Top 0.254: D12.A 44.35,18.86 R44.1
N$35  (via drill 0.55)
  Top 0.406: v44.27,28.56 U5.EMIT 44.27,32.74 R46.1
  Bottom 0.406: v44.27,28.56 44.23,28.6 42,28.6 R45.1
N$36  (via drill 0.6)
  Top 0.508: 49.75,21.42 U6.A
  Top 0.61: v49.75,24.24 49.75,21.42
  Bottom 0.61: R47.2 v49.75,24.24
N$37
  Top 0.254: D13.A 52.24,18.86 R48.1
N$38  (via drill 0.55)
  Top 0.406: v52.27,28.56 U6.EMIT R50.1
  Bottom 0.406: v52.27,28.56 52.23,28.6 50,28.6 R49.1
N$39  (via drill 0.6)
  Top 0.508: 57.79,21.46 U7.A
  Top 0.61: v57.79,24.24 57.79,21.46
  Bottom 0.61: R51.2 v57.79,24.24
N$40
  Top 0.254: D14.A 60.35,18.86 R52.1
N$41  (via drill 0.55)
  Top 0.406: v60.27,28.43 U7.EMIT 60.3,30.43 R54.1
  Bottom 0.406: v60.27,28.43 57.8,28.43 R53.1
N$42  (via drill 0.6)
  Top 0.61: v13.29,23.48 11.1,23.48 10.59,22.97 U1.A
  Bottom 0.61: R1.2 C1.2 v13.29,23.48
OUTPUT
  Top 1.016: IC2.2 24.69,52.46 D8.C
  pour Top (no thermals): 25.64,52.52 25.64,70.93 21.07,70.93 21.07,59.88 23.86,57.09 23.86,52.52
RESET  (via drill 0.55)
  Top 0.254: v45.09,54.86 44.71,54.49 IC3.4-NRST | SWD.1 65.72,54.32 65.23,53.83 R7.1
  Bottom 0.254: v45.09,54.86 45.09,56.09 46.51,57.51 63.87,57.51 65,56.37 65,54.88 65.55,54.33 66.73,54.33 SWD.1
SCL  (via drill 0.55, 0.6)
  Top 0.305: IC3.29-PB6 46.82,56.31 48.93,54.2 v49.02,54.2
  Top 0.406: v72.51,25.38 72.51,24.62 73.29,23.83 IC4.SCL1 | v67.11,48 70,48 74.67,43.33 v74.67,29.34
  Bottom 0.406: v72.51,25.38 72.54,25.41 R24.1 v74.67,29.34 | v49.02,54.2 50.26,54.2 51.56,55.5 57.66,55.5 59.6,53.55 59.6,49.63 61.24,48 v67.11,48
SCL_ISO  (via drill 0.55)
  Top 0.406: IC4.SCL2 73.29,15.06 72.51,14.27 v72.51,13.03
  Bottom 0.406: v72.51,13.03 74.53,13.03 R6.1
  Bottom 0.61: R6.1 74.6,11.36 75.94,10.02 79.87,10.02 81,8.89 J3.P$4
SDA  (via drill 0.55, 0.6)
  Top 0.305: v47.13,53.34 47.13,54.62 46.02,55.73 IC3.30-PB7
  Top 0.406: IC4.SDA1 74.56,25.36 R23.1 74.66,27.27 74.17,27.76 73.38,27.76 72.94,28.21 72.94,42.95 69.64,46.25 v65,46.25
  Bottom 0.305: v47.13,53.34 47.13,53.4
  Bottom 0.406: v47.13,53.34 47.85,52.62 50.73,52.62 52.37,54.25 56.91,54.25 58.11,53.05 58.11,48.89 60.75,46.25 v65,46.25 65.13,46.25
SDA_ISO
  Top 0.406: R5.1 74.56,12.95 IC4.SDA2
  Top 0.61: J3.P$3 74.58,8.02 R5.1
SWCLK  (via drill 0.55)
  Top 0.254: IC3.24-PA14 53.38,56.89 54.11,57.62 54.11,59.38 v53.38,60.09
  Bottom 0.254: v53.38,60.09 54.16,59.31 56.39,59.31 57.53,60.45 68.64,60.45 69.28,59.81 SWD.4
SWDAT  (via drill 0.55)
  Top 0.254: IC3.23-PA13 54.24,56.09 55.49,57.34 v55.49,60.58
  Bottom 0.254: SWD.6 71.81,60.62 71.25,61.18 56.09,61.18 v55.49,60.58
SWO  (via drill 0.55)
  Top 0.254: IC3.26-PB3 v49.22,56.01
  Bottom 0.254: v49.22,56.01 49.85,56.64 63.37,56.64 64,56.02 64,53.77 65.25,52.52 68.83,52.52 69.28,52.96 SWD.3

### Text on the board
tPlace: Elevator Main Board | PCBD - 1572 | Input 12VDC, 3A | 3.3V Logic | TOP | B2 | Mode Indicator | FAULT | B1 | WAIT | READY | A1 | A2 | Inputs | I2C-Bs
tNames: 12VDC OUTPUTS | 12VDC IN